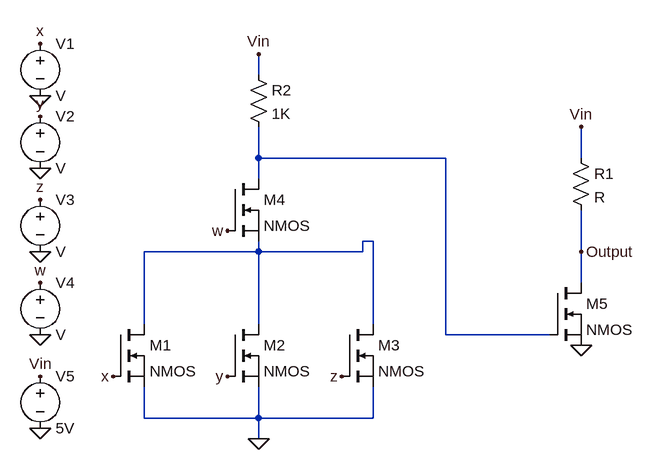
[diagram p0: schematic 20101331_Shadman Sakib_Q1.asc]
20101331_Shadman Sakib_Q1.asc, the LTspice schematic file:
Version 4
SHEET 1 1048 680
WIRE 400 -64 400 -96
WIRE 400 64 400 16
WIRE 688 64 400 64
WIRE 896 64 896 16
WIRE 400 96 400 64
WIRE 576 192 560 192
WIRE 400 208 400 192
WIRE 400 208 224 208
WIRE 560 208 560 192
WIRE 560 208 400 208
WIRE 896 208 896 144
WIRE 896 256 896 208
WIRE 224 320 224 208
WIRE 400 320 400 208
WIRE 576 320 576 192
WIRE 688 336 688 64
WIRE 848 336 688 336
WIRE 224 464 224 416
WIRE 400 464 400 416
WIRE 400 464 224 464
WIRE 576 464 576 416
WIRE 576 464 400 464
WIRE 400 496 400 464
FLAG 896 352 0
FLAG 400 496 0
FLAG 64 -32 0
FLAG 64 80 0
FLAG 64 208 0
FLAG 64 336 0
FLAG 64 480 0
FLAG 64 -112 x
FLAG 64 0 y
FLAG 64 128 z
FLAG 64 256 w
FLAG 64 400 Vin
FLAG 352 176 w
FLAG 176 400 x
FLAG 352 400 y
FLAG 528 400 z
FLAG 400 -96 Vin
FLAG 896 16 Vin
FLAG 896 208 Output
SYMBOL voltage 64 -128 R0
SYMATTR InstName V1
SYMBOL voltage 64 -16 R0
SYMATTR InstName V2
SYMBOL voltage 64 112 R0
SYMATTR InstName V3
SYMBOL voltage 64 240 R0
SYMATTR InstName V4
SYMBOL voltage 64 384 R0
WINDOW 123 0 0 Left 0
WINDOW 39 0 0 Left 0
SYMATTR InstName V5
SYMATTR Value 5V
SYMBOL nmos 176 320 R0
SYMATTR InstName M1
SYMBOL nmos 352 320 R0
SYMATTR InstName M2
SYMBOL nmos 528 320 R0
SYMATTR InstName M3
SYMBOL nmos 352 96 R0
SYMATTR InstName M4
SYMBOL nmos 848 256 R0
SYMATTR InstName M5
SYMBOL res 384 -80 R0
SYMATTR InstName R2
SYMATTR Value 1K
SYMBOL res 880 48 R0
SYMATTR InstName R1

The netlist it stands for:
* 20101331_Shadman Sakib_Q1.asc
V1 x 0 V
V2 y 0 V
V3 z 0 V
V4 w 0 V
V5 Vin 0 5V
M1 N002 x 0 0 NMOS
M2 N002 y 0 0 NMOS
M3 N002 z 0 0 NMOS
M4 N001 w N002 N002 NMOS
M5 Output N001 0 0 NMOS
R2 Vin N001 1K
R1 Vin Output R
.model NMOS NMOS
.model PMOS PMOS
.lib standard.mos
.backanno
.end